# Altium schematic sheet Par_Conditioning.SchDoc: Throttle conditioning
size A3; Organization: ORGANIZATION; Address1: ADDRESS 1; Address2: ADDRESS 2; Address3: ADDRESS 3; Address4: ADDRESS 4; Revision: 0.0; SheetNumber: 6; SheetTotal: 19; ENG_APP_DATE: --/--/--; DSN_APP_DATE: --/--/--; CHK_APP_DATE: --/--/--
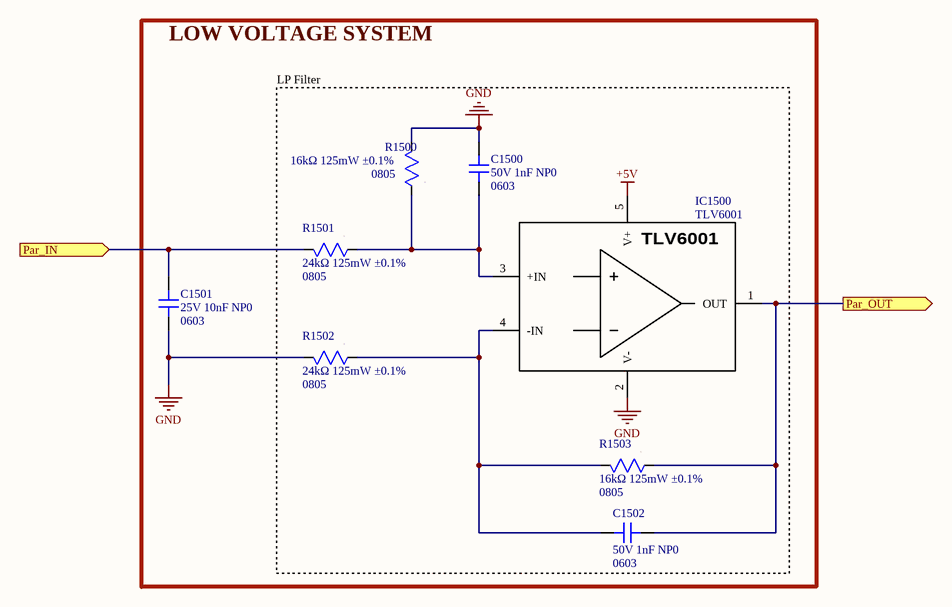
[diagram p0: Par_Conditioning.SchDoc]

## Parts
C1500  value 50V 1nF NP0  Package: 0603  [CAP SMD 0603]  (hidden comment: CAP non polarized)
C1501  value 25V 10nF NP0  Package: 0603  [CAP SMD 0603]  (hidden comment: CAP non polarized)
C1502  value 50V 1nF NP0  Package: 0603  [CAP SMD 0603]  (hidden comment: CAP non polarized)
IC1500  TLV6001  [SOT-23-5]
R1500  value 16kΩ 125mW ±0.1%  Package: 0805  [RES SMD 0805]  (hidden comment: RES)
R1501  value 24kΩ 125mW ±0.1%  Package: 0805  [RES SMD 0805]  (hidden comment: RES)
R1502  value 24kΩ 125mW ±0.1%  Package: 0805  [RES SMD 0805]  (hidden comment: RES)
R1503  value 16kΩ 125mW ±0.1%  Package: 0805  [RES SMD 0805]  (hidden comment: RES)

## Blocks framed on the sheet
LOW VOLTAGE SYSTEM: C1501
LP Filter: C1500 C1502 IC1500 R1500-R1503

## Ports
Par_IN (in), Par_OUT (out)

## Nets
+5V: IC1500.5(V+)
GND: C1500.1 C1501.2 IC1500.2(V-) R1500.2 R1502.2
Par_IN: C1501.1 R1501.2 ; port Par_IN
Par_OUT: C1502.2 IC1500.1(OUT) R1503.1 ; port Par_OUT
NetC1500_2: C1500.2 IC1500.3(+IN) R1500.1 R1501.1
NetC1502_1: C1502.1 IC1500.4(-IN) R1502.1 R1503.2

## Notes on the sheet
- Project:
- Subsystem:
- Company:
- Document:
- Author:
- Revision:
- Date:
- Sheet:
- /

## Library data of the parts
C1500 C1502 = 001-0127: Condensadores de cerámica multicapa (MLCC- SMD/SMT) WCAP-CSGP 1000pF 0603 5% 50V MLCC; MPN: 885012006063; Manufacturer: Wurth Elektronik; ComponentLink1Description: Datasheet; ComponentLink1URL: https://www.we-online.com/components/products/datasheet/885012006063.pdf; ComponentLink2Description: Distributor Link; ComponentLink2URL: https://www.mouser.es/ProductDetail/Wurth-Elektronik/885012006063?qs=0KOYDY2FL29yUmMQmcJrdA%3D%3D; ID: 001-0127; Distributor PN: 710-885012006063; Distributor: Mouser
C1501 = 001-0107: Condensadores de cerámica multicapa (MLCC- SMD/SMT) 0.01 uF 25 VDC 1% 0603 C0G (NP0) AEC-Q200; MPN: GRT1885C1E103FA02D; Manufacturer: muRata; ComponentLink1Description: Datasheet; ComponentLink1URL: https://www.mouser.es/datasheet/3/76/2/GRT1885C1E103FA02_01A.pdf; ComponentLink2Description: Distributor Link; ComponentLink2URL: https://www.mouser.es/ProductDetail/Murata-Electronics/GRT1885C1E103FA02D?qs=xZ%2FP%252Ba9zWqaqiXqJj78%252Bmg%3D%3D; ID: 001-0107; Distributor PN: 81-GRT1885C1E103FA2D; Distributor: Mouser
IC1500 = 062-0002: Amplificadores operacionales - Op Amps Single 5.5-V 1-MHz R RIO operational a A A 595-TLV6001UIDBVT; MPN: TLV6001UIDBVR; Manufacturer: Texas Instruments; ID: 062-0002; ComponentLink1URL: https://www.ti.com/lit/ds/symlink/tlv6001.pdf?ts=1781607824916&ref_url=https%253A%252F%252Fcz.mouser.com%252F; ComponentLink2URL: https://www.mouser.es/ProductDetail/Texas-Instruments/TLV6001UIDBVR?qs=8N88piwwHEgntIgM8jjJ5Q%3D%3D; Value: -; Package: SOT-23-5; Distributor PN: 595-TLV6001UIDBVR; Distributor: Mouser
R1500 R1503 = 010-0184: Resistores de película fina - SMD 0805 16Kohm 0.1% 10ppm AEC-Q200; MPN: ERA-6ARB163V; Manufacturer: Panasonic; ComponentLink1Description: Datasheet; ComponentLink1URL: https://industrial.panasonic.com/cdbs/www-data/pdf/RDM0000/AOA0000C307.pdf; ComponentLink2Description: Distributor Link; ComponentLink2URL: https://www.mouser.es/ProductDetail/Panasonic/ERA-6ARB163V?qs=sGAEpiMZZMtlubZbdhIBIJiMSTY83nT4nukUMCYb38k%3D; ID: 010-0184; Distributor PN: 667-ERA-6ARB163V; Distributor: Mouser
R1501 R1502 = 010-0185: Resistores de película fina - SMD 0805 24Kohm 0.1% 15ppm AEC-Q200; MPN: ERA-6APB243V; Manufacturer: Panasonic; ComponentLink1Description: Datasheet; ComponentLink1URL: https://industrial.panasonic.com/cdbs/www-data/pdf/RDM0000/AOA0000C307.pdf; ComponentLink2Description: Distributor Link; ComponentLink2URL: https://www.mouser.es/ProductDetail/Panasonic/ERA-6APB243V?qs=ob%252BdNz2%252BYEgwblk2D2VCQQ%3D%3D; ID: 010-0185; Distributor PN: 667-ERA-6APB243V; Distributor: Mouser